# EAGLE design AVRispMK2_V2 (EAGLE 8.1.1)
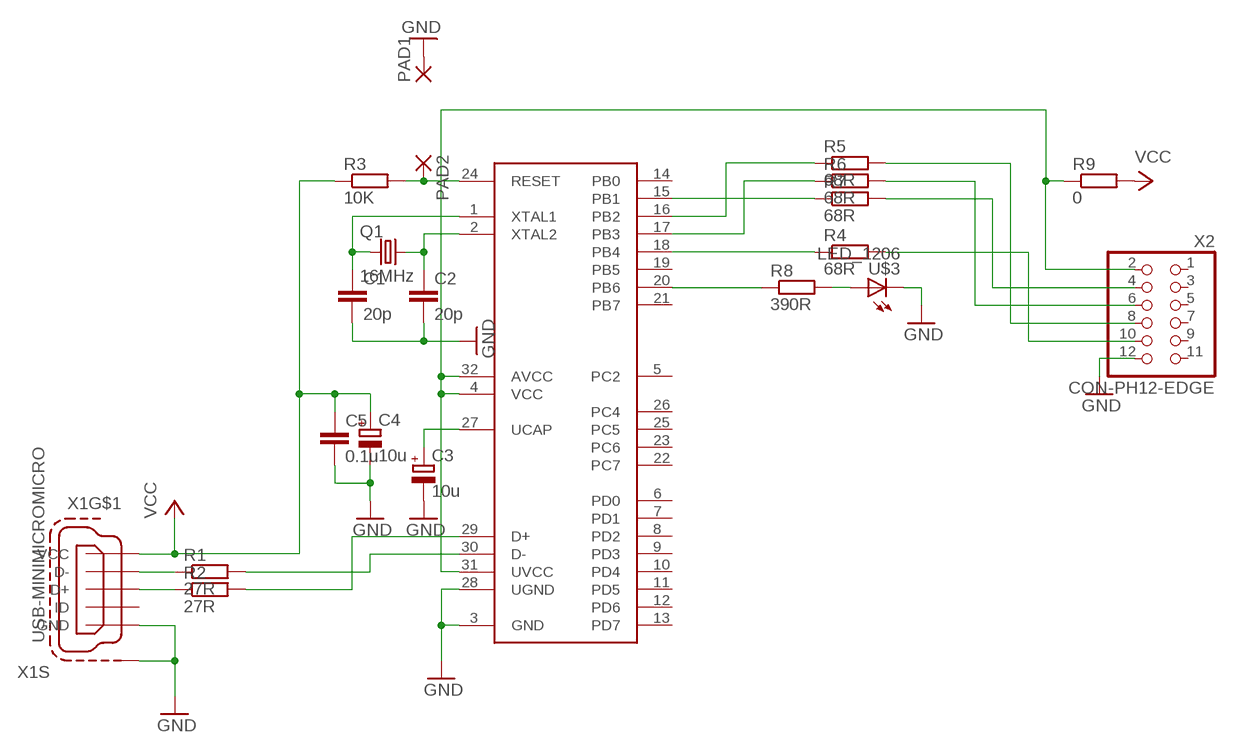
[diagram p0: schematic, sheet 1]

## Parts
C1  20p  C-EUC1206  [C1206]
C2  20p  C-EUC1206  [C1206]
C3  10u  CPOL-EUSMCA  [SMC_A]
C4  10u  CPOL-EUSMCA  [SMC_A]
C5  0.1u  C-EUC1206  [C1206]
PAD1  SMD2  [SMD1,27-2,54]
PAD2  SMD2  [SMD1,27-2,54]
Q1  16MHz  CRYSTAL3225  [CRYSTAL-3225]
R1  27R  R-EU_R1206  [R1206]
R2  27R  R-EU_R1206  [R1206]
R3  10K  R-EU_R1206  [R1206]
R4  68R  R-EU_R1206  [R1206]
R5  68R  R-EU_R1206  [R1206]
R6  68R  R-EU_R1206  [R1206]
R7  68R  R-EU_R1206  [R1206]
R8  390R  R-EU_R1206  [R1206]
R9  0  R-EU_R1206  [R1206]
U$1  AT90USB162  [VQFP32]
U$3  LED_1206  [LED1206]
X1  USB-MINIMICROMICRO  [USB-B-MICRO-SMD]
X2  CON-PH12-EDGE  [ML12_EDGE_SMD]

## Nets
!RST: R4.2 X2.10
GND: C1.2 C2.2 C3.- C4.- C5.2 PAD1.1(P) U$1.3(GND) U$1.28(UGND) U$3.C X1.GND X1.SHIELD1(S:S1) X1.SHIELD2(S:S1) X1.SHIELD3(S:S1) X2.12
MISO: R6.2 X2.6
MOSI: R5.2 X2.8
N$1: R2.1 X1.D+
N$2: R1.1 X1.D-
N$3: C1.1 Q1.P$2 U$1.1(XTAL1)
N$4: C2.1 Q1.P$4 U$1.2(XTAL2)
N$5: R1.2 U$1.30(D-)
N$6: R2.2 U$1.29(D+)
N$7: C3.+ U$1.27(UCAP)
N$9: PAD2.1(P) R3.2 U$1.24(RESET)
N$10: R8.1 U$1.20(PB6)
N$11: R8.2 U$3.A
N$16: R4.1 U$1.18(PB4)
N$17: R6.1 U$1.17(PB3)
N$18: R5.1 U$1.16(PB2)
N$19: R7.1 U$1.15(PB1)
SCK: R7.2 X2.4
VCC: C4.+ C5.1 R3.1 R9.2 X1.VBUS(VCC)
VTRG: R9.1 U$1.4(VCC) U$1.31(UVCC) U$1.32(AVCC) X2.2
Unconnected: U$1.5(PC2) U$1.6(PD0) U$1.7(PD1) U$1.8(PD2) U$1.9(PD3) U$1.10(PD4) U$1.11(PD5) U$1.12(PD6) U$1.13(PD7) U$1.14(PB0) U$1.19(PB5) U$1.21(PB7) U$1.22(PC7) U$1.23(PC6) U$1.25(PC5) U$1.26(PC4) X1.ID X2.1 X2.3 X2.5 X2.7 X2.9 X2.11

## Library data of the parts
C1 C2 C5 = rcl:C-EU: CAPACITOR, European symbol
C3 C4 = rcl:CPOL-EU: POLARIZED CAPACITOR, European symbol
PAD1 PAD2 = wirepad:SMD2: SMD PAD
Q1 = Namenlos:CRYSTAL
R1-R9 = rcl:R-EU_: RESISTOR, European symbol
U$1 = at90usb:AT90USB162
U$3 = Namenlos:LED_
X1 = Namenlos:USB-MINIMICRO: MINI USB-B Conector Source: www.cypressindustries.com
X2 = Namenlos:CON-PH12-EDGE

## Board
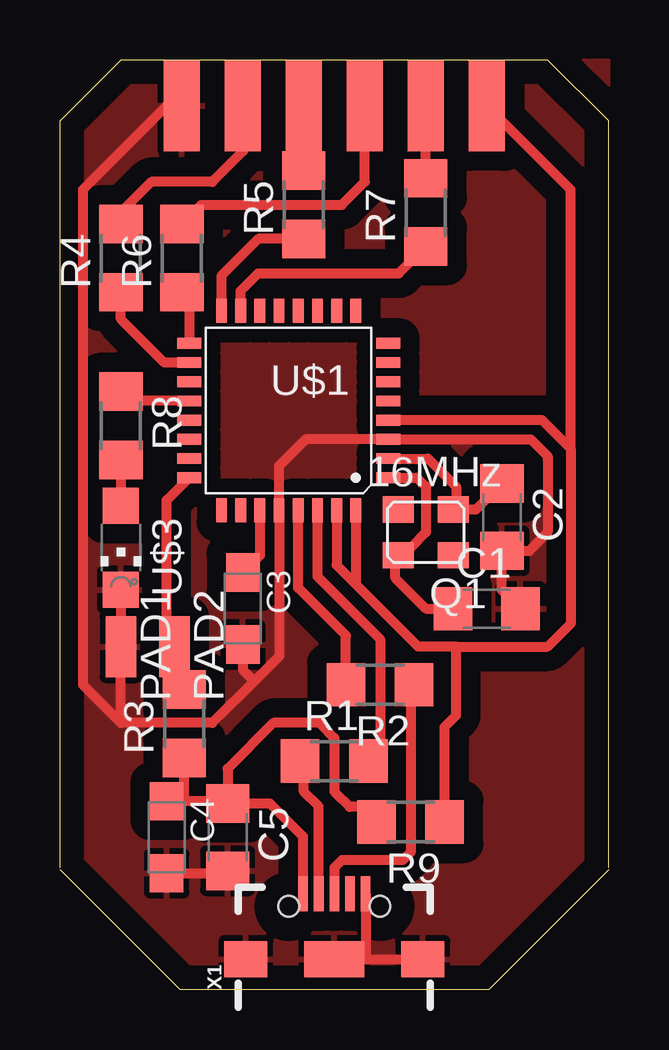
[diagram p1: board, top side]
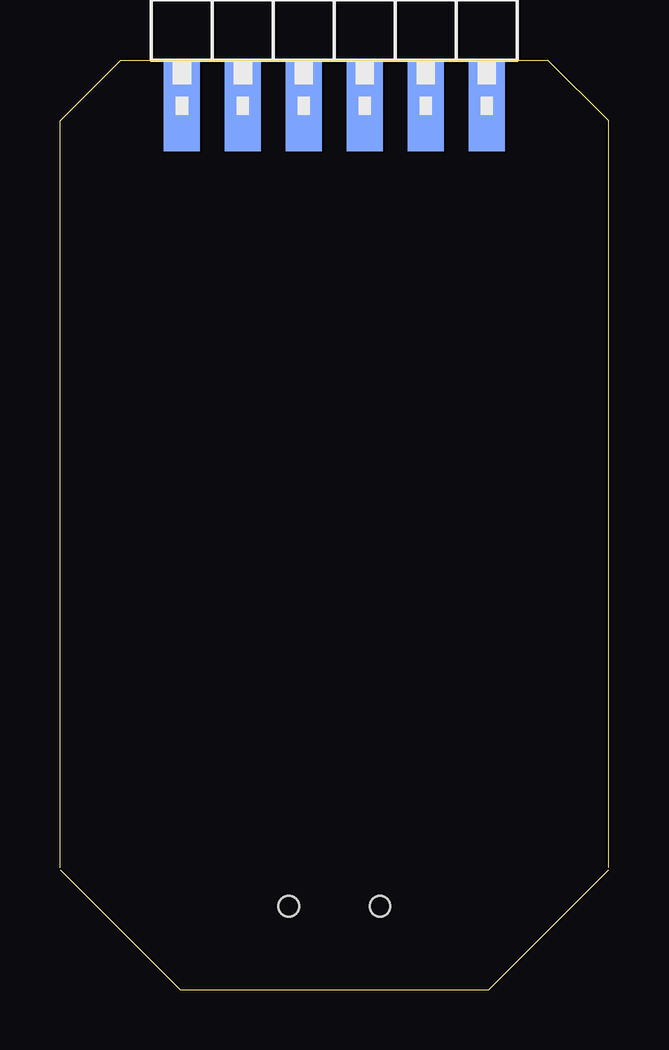
[diagram p2: board, bottom side, seen from below]

Size 22.86 x 38.73 mm. Coordinates in mm from the lower left corner, seen from the top.
Outline: 0,5 5,0 17.86,0 22.86,5
Outline: 22.86,5.08 22.86,36.2 20.32,38.73 2.54,38.73 0,36.2 0,5.08
Copper layers (1*16): Top 0.035mm / dielectric 1.5mm / Bottom 0.035mm
Design rules "EagleDesignRules": minimum track width 0.2mm, minimum drill 0.3mm, track to track 0.2mm, track to pad 0.2mm, pad to pad 0.2mm, via to via 0.2mm, smd to smd 0.2mm, copper to edge 1mm, drill to drill 0.2mm, minimum pad ring 10mil, minimum via ring 8mil, stop-mask expansion 4mil, vias tented up to drill 0mil, thermal gap 0.25mm

### Footprints (pad centres in the part's own frame; a part is rotated, then mirrored left to right if it is on the bottom)
C1206 = smd 1.6 x 1.8: 1 -1.4,0; 2 1.4,0
SMC_A = smd 1.6 x 1.4: + -1.5,0; - 1.5,0
SMD1,27-2,54 = smd 1.27 x 2.54: 1 0,0
CRYSTAL-3225 = smd 1.3 x 1.1: GND@1 -1.15,0.95; GND@2 1.15,-0.95; P$2 1.15,0.95; P$4 -1.15,-0.95
R1206 = smd 1.6 x 1.803: 1 -1.422,0; 2 1.422,0
VQFP32 = smd 1 x 0.45: 1 -4.15,2.8; 2 -4.15,2; 3 -4.15,1.2; 4 -4.15,0.4; 5 -4.15,-0.4; 6 -4.15,-1.2; 7 -4.15,-2; 8 -4.15,-2.8; 17 4.15,-2.8; 18 4.15,-2; 19 4.15,-1.2; 20 4.15,-0.4; 21 4.15,0.4; 22 4.15,1.2; 23 4.15,2; 24 4.15,2.8 | smd 0.45 x 1: 9 -2.8,-4.15; 10 -2,-4.15; 11 -1.2,-4.15; 12 -0.4,-4.15; 13 0.4,-4.15; 14 1.2,-4.15; 15 2,-4.15; 16 2.8,-4.15; 25 2.8,4.15; 26 2,4.15; 27 1.2,4.15; 28 0.4,4.15; 29 -0.4,4.15; 30 -1.2,4.15; 31 -2,4.15; 32 -2.8,4.15
LED1206 = smd 1.5 x 1.5: A 0,-1.75; C 0,1.75
USB-B-MICRO-SMD = smd 1.45 x 0.4: D+ 2.725,0; D- 2.725,0.65; GND 2.725,-1.3; ID 2.725,-0.65; VBUS 2.725,1.3 | smd 1.5 x 1.8: SHIELD1 0,3.685; SHIELD2 0,-3.685 | smd 1.5 x 2.5: SHIELD3 0,0 | hole 0.85: 2.2,1.9; 2.2,-1.9
ML12_EDGE_SMD = smd 1.5 x 3.81: 1 -6.35,-6.35; 3 -3.81,-6.35; 5 -1.27,-6.35; 7 1.27,-6.35; 9 3.81,-6.35; 11 6.35,-6.35 | smd 1.5 x 3.81 bottom: 2 -6.35,-6.35; 4 -3.81,-6.35; 6 -1.27,-6.35; 8 1.27,-6.35; 10 3.81,-6.35; 12 6.35,-6.35

### Placement (x,y rotation side)
C1  17.78,15.88 0 top
C2  18.41,19.68 270 top
C3  7.62,15.88 270 top
C4  4.45,6.35 270 top
C5  6.98,6.35 270 top
PAD1  2.54,14.29 180 top
PAD2  4.76,14.29 180 top
Q1  15.24,19.05 180 top
R1  11.43,9.52 0 top
R2  13.34,12.7 180 top
R3  5.18,11.08 90 top
R4  2.54,30.48 90 top
R5  10.16,32.7 90 top
R6  5.08,30.48 90 top
R7  15.24,32.39 90 top
R8  2.54,23.5 270 top
R9  14.61,6.99 180 top
U$1  9.53,24.13 180 top
U$3  2.54,18.41 180 top
X1  11.43,1.27 90 top
X2  11.43,43.18 0 bottom

### Tracks (layer width: path | path; a pad name or v marks a point on that pad's centre or on a via)
!RST
  Top 0.406: R4.2 2.54,32.39 3.81,33.66 6.35,33.66 7.62,34.93 X2.10
GND
  Top 0.406: U$3.C PAD1.1 2.54,11.11 | C4.- 6.88,4.85 C5.2 | 8.1,12.86 9.12,13.89 U$1.28 9.12,21.82 10.23,22.93 U$1.3 19.61,22.93 20.32,22.22 20.32,19.05 19.55,18.29 C2.2 18.41,16.64 C1.2 | 8.1,12.86 6.35,11.11 2.54,11.11 | C3.- 7.62,13.34 8.1,12.86 | X1.GND 12.73,1.3 12.7,1.27 X1.SHIELD2 | X2.12 4.45,36.83 0.95,33.34 0.95,12.7 2.54,11.11
  pour Top (isolate 0.813): 22.86,38.73 2.54,38.73 0,36.2 0,5.08 5.08,0 17.78,0 22.86,5.08
MISO
  Top 0.406: R6.2 5.88,32.7 11.75,32.7 12.7,33.66 X2.6
MOSI
  Top 0.406: R5.2 X2.8
N$1
  Top 0.406: 14.61,12.7 14.61,13.18 | 14.61,12.7 14.61,5.72 14.29,5.4 11.75,5.4 11.43,5.08 X1.D+ | R2.1 14.61,12.7
N$2
  Top 0.406: X1.D- 10.78,7.64 10.16,8.25 10.16,9.37 R1.1
N$3
  Top 0.406: U$1.1 14.86,21.33 15.24,20.95 15.24,19.05 14.61,18.41 14.41,18.41 Q1.P$2 13.97,17.98 13.97,17.14 15.24,15.88 C1.1
N$4
  Top 0.406: U$1.2 15.34,22.13 16.51,20.95 16.51,20.12 Q1.P$4 17.33,20 C2.1
N$5
  Top 0.406: U$1.30 10.72,17.21 13.34,14.61 13.34,10.01 R1.2
N$6
  Top 0.406: U$1.29 9.92,16.75 11.91,14.76 R2.2
N$7
  Top 0.406: U$1.27 8.32,18.08 C3.+
N$9
  Top 0.406: R3.2 5.18,12.6 4.45,13.34 4.45,13.97 | 4.45,13.97 4.45,20.4 U$1.24 | PAD2.1 4.45,13.97
N$10
  Top 0.406: U$1.20 2.93,24.53 R8.1
N$11
  Top 0.406: R8.2 U$3.A
N$16
  Top 0.406: U$1.18 4.35,26.13 2.54,27.94 R4.1
N$17
  Top 0.406: U$1.17 5.38,28.72 5.08,29.01 R6.1
N$18
  Top 0.406: U$1.16 6.72,29.74 8.27,31.28 R5.1
N$19
  Top 0.406: U$1.15 7.53,29.11 8.25,29.85 14.12,29.85 R7.1
SCK
  Top 0.406: R7.2 X2.4
VCC
  Top 0.406: 6.98,7.85 7.52,7.85 | 6.98,7.85 C4.+ 4.54,7.95 5.18,7.95 R3.1 | X1.VBUS 10.13,6.38 8.76,7.75 C5.1 6.98,7.85 | 12.7,7.62 12.07,7.62 11.43,8.25 11.43,10.48 10.79,11.11 8.89,11.11 6.98,9.21 6.98,7.85 | 12.7,7.62 13.34,7.62 | R9.2 13.18,7.14 12.7,7.62
VTRG
  Top 0.406: U$1.4 20.09,23.73 21.27,22.54 | 21.27,22.54 21.27,15.24 20.32,14.29 16.51,14.29 | U$1.32 12.32,16.88 | 12.32,16.88 14.92,14.29 16.51,14.29 | U$1.31 11.53,17.68 12.32,16.88 | R9.1 16.03,10.95 16.51,11.43 16.51,14.29 | 21.27,22.54 21.27,33.34 X2.2